# EAGLE schematic LCD_Shield (EAGLE 5.10)
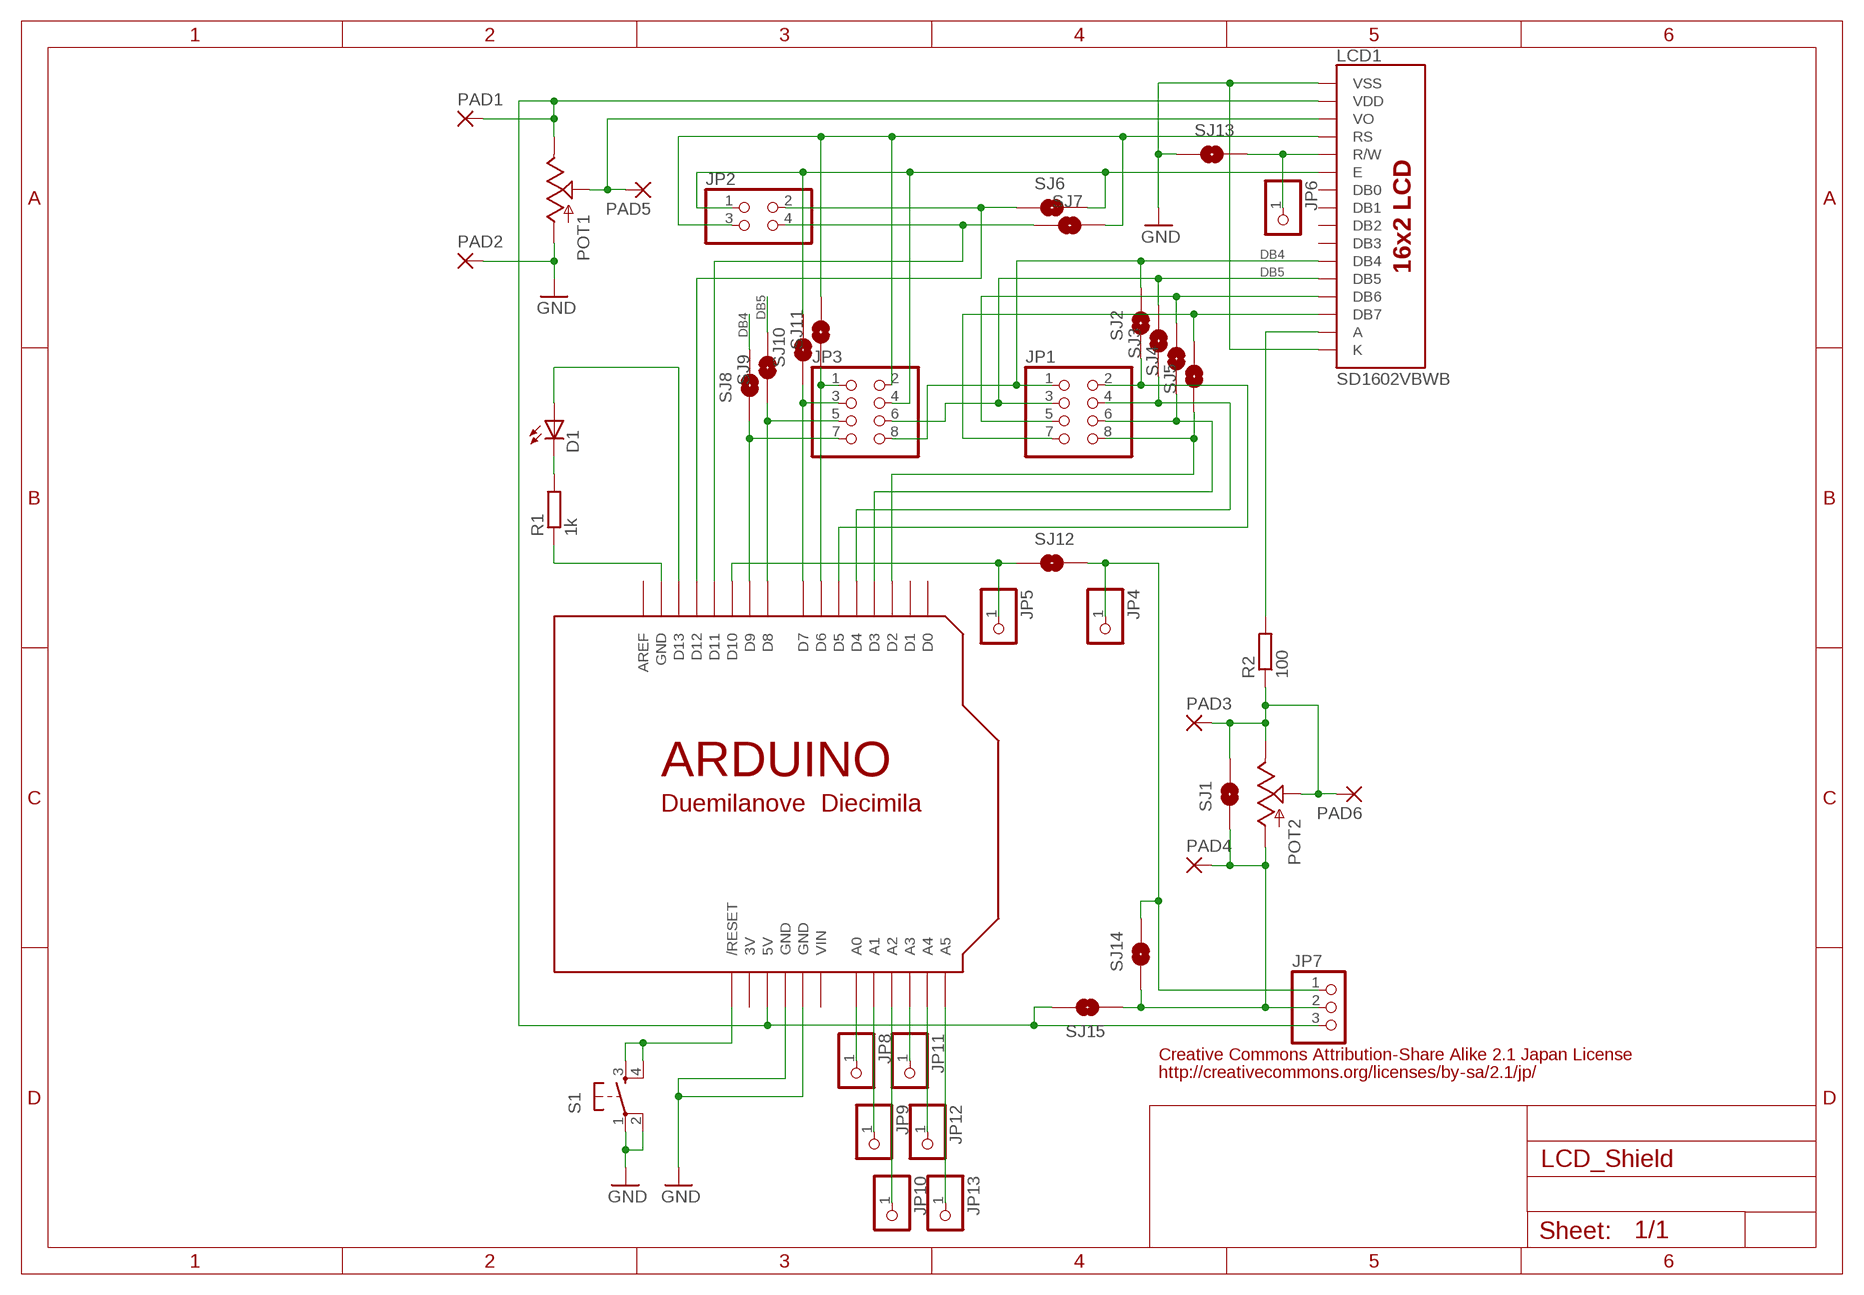
[diagram p0: schematic, sheet 1]

## Parts
D1  LED3MM  [LED3MM]
JP1  PINHD-2X4  [2X04]
JP2  PINHD-2X2  [2X02]
JP3  PINHD-2X4  [2X04]
JP4  PINHD-1X1  [1X01]
JP5  PINHD-1X1  [1X01]
JP6  PINHD-1X1  [1X01]
JP7  PINHD-1X3CB  [1X03-CLEANBIG]
JP8  PINHD-1X1  [1X01]
JP9  PINHD-1X1  [1X01]
JP10  PINHD-1X1  [1X01]
JP11  PINHD-1X1  [1X01]
JP12  PINHD-1X1  [1X01]
JP13  PINHD-1X1  [1X01]
LCD1  SD1602VBWB  [SD1602VBWB]
PAD1  1,6/0,8  [1,6/0,8]
PAD2  1,6/0,8  [1,6/0,8]
PAD3  1,6/0,8  [1,6/0,8]
PAD4  1,6/0,8  [1,6/0,8]
PAD5  1,6/0,8  [1,6/0,8]
PAD6  1,6/0,8  [1,6/0,8]
POT1  POTTRIM  [TRIM_POT]
POT2  POTTRIM  [TRIM_POT]
R1  1k  R-EU_0204/7  [0204/7]
R2  100  R-EU_0204/7  [0204/7]
S1  TAC_SWITCHPTH  [TACTILE-PTH]
SJ1  SOLDERJUMPERNO  [SJ_2S-NO]
SJ2  SOLDERJUMPERNO  [SJ_2S-NO]
SJ3  SOLDERJUMPERNO  [SJ_2S-NO]
SJ4  SOLDERJUMPERNO  [SJ_2S-NO]
SJ5  SOLDERJUMPERNO  [SJ_2S-NO]
SJ6  SOLDERJUMPERNO  [SJ_2S-NO]
SJ7  SOLDERJUMPERNO  [SJ_2S-NO]
SJ8  SOLDERJUMPERNO  [SJ_2S-NO]
SJ9  SOLDERJUMPERNO  [SJ_2S-NO]
SJ10  SOLDERJUMPERNO  [SJ_2S-NO]
SJ11  SOLDERJUMPERNO  [SJ_2S-NO]
SJ12  SOLDERJUMPERNO  [SJ_2S-NO]
SJ13  SOLDERJUMPERNC  [SJ_2S]
SJ14  SOLDERJUMPERNO  [SJ_2S-NO]
SJ15  SOLDERJUMPERNO  [SJ_2S-NO]
U$1  ARDUINODUEMILANOVE-NOHOLES  [ARDUINO-NOHOLE]

## Nets
DB4: JP1.1 JP3.8 LCD1.P$11(DB4) SJ2.2 SJ8.2
DB5: JP1.3 JP3.6 LCD1.P$12(DB5) SJ3.2 SJ9.2
GND: LCD1.P$01(VSS) LCD1.P$16(K) PAD2.1(P) POT1.3(A) S1.1 S1.2 SJ13.1 U$1.GND1(GND) U$1.GND2(GND)
N$1: D1.K(C) R1.2
N$2: R1.1 U$1.GND
N$3: JP5.1 SJ12.1 U$1.D10
N$4: JP4.1 JP7.1 SJ12.2 SJ14.2
N$5: JP1.5 LCD1.P$13(DB6) SJ4.2
N$6: JP1.7 LCD1.P$14(DB7) SJ5.2
N$7: JP1.8 SJ5.1 U$1.D2
N$8: JP1.6 SJ4.1 U$1.D3
N$9: JP8.1 U$1.A0
N$10: JP1.2 SJ2.1 U$1.D5
N$11: JP3.3 SJ10.1 U$1.D7
N$12: JP2.1 JP3.4 LCD1.P$06(E) SJ6.2 SJ10.2
N$13: JP2.3 JP3.2 LCD1.P$04(RS) SJ7.2 SJ11.2
N$14: D1.A U$1.D13
N$15: PAD3.1(P) PAD6.1(P) POT2.1(S) POT2.2(E) R2.1 SJ1.2
N$16: JP3.1 SJ11.1 U$1.D6
N$17: JP6.1 LCD1.P$05(R/W) SJ13.2
N$18: JP3.7 SJ8.1 U$1.D9
N$19: JP3.5 SJ9.1 U$1.D8
N$20: JP1.4 SJ3.1 U$1.D4
N$21: JP9.1 U$1.A1
N$22: JP10.1 U$1.A2
N$23: JP11.1 U$1.A3
N$24: JP2.2 SJ6.1 U$1.D12
N$25: JP2.4 SJ7.1 U$1.D11
N$26: JP7.3 LCD1.P$02(VDD) PAD1.1(P) POT1.2(E) SJ15.2 U$1.5V
N$27: JP12.1 U$1.A4
N$28: JP13.1 U$1.A5
N$29: JP7.2 PAD4.1(P) POT2.3(A) SJ1.1 SJ14.1 SJ15.1
N$30: LCD1.P$15(A) R2.2
N$31: S1.3 S1.4 U$1.RESET(/RESET)
N$34: LCD1.P$03(VO) PAD5.1(P) POT1.1(S)
Unconnected: LCD1.P$07(DB0) LCD1.P$08(DB1) LCD1.P$09(DB2) LCD1.P$10(DB3) U$1.AREF U$1.D0 U$1.D1

## Notes on the sheet
- Creative Commons Attribution-Share Alike 2.1 Japan License
- http://creativecommons.org/licenses/by-sa/2.1/jp/

## Power pins joined to a net without a drawn wire
3V: U$1.3V
VIN: U$1.VIN

## Library data of the parts
D1 = SparkFun:LED: LEDs Standard schematic elements and footprints for 5mm, 3mm, 1206, and 0603 sized LEDs. 5mm - Spark Fun Electronics SKU : COM-00529 (and others)
JP1 JP3 = pinhead:PINHD-2X4: PIN HEADER
JP2 = pinhead:PINHD-2X2: PIN HEADER
JP4-JP6 JP8-JP13 = pinhead:PINHD-1X1: PIN HEADER
JP7 = adafruit:PINHD-1X3: PIN HEADER
LCD1 = SUNLIKE_LCD_SD1602:SD1602VBWB
PAD1-PAD6 = wirepad:1,6/0,8: THROUGH-HOLE PAD
POT1 POT2 = SparkFun:POT
R1 R2 = rcl:R-EU_: RESISTOR, European symbol
S1 = SparkFun:TAC_SWITCH: Momentary Switch Button commonly used for reset or general input. Spark Fun Electronics SKU : COM-00097
SJ1-SJ15 = SparkFun:SOLDERJUMPER: Solder Jumper Standard SMD solder jumper. Used to automate production. Two varients : Normally Open and Normally Closed are the same, but have different paste layers. NC will have a large amount of paste and should jumper during reflow.
U$1 = adafruit:ARDUINO: Arduino Diecimila/Duemilanove Make a shield with ease, this package has all the named pins as well as the two mounting drill holes and an outline of the USB and DC power connector. The outline is on the DIMENSION layer, so if your board house uses it they will cut the outline to match. http://www.ladyada.net/library/pcb/eaglelibrary.html